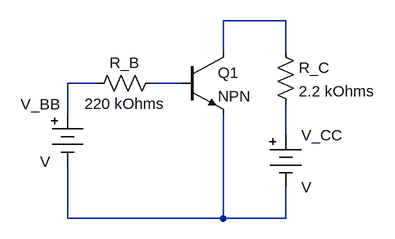
[diagram p0: schematic fig1.asc]
fig1.asc, the LTspice schematic file:
Version 4
SHEET 1 880 680
WIRE 304 -32 208 -32
WIRE 208 16 208 -32
WIRE 304 16 304 -32
WIRE 16 64 -32 64
WIRE 144 64 96 64
WIRE -32 112 -32 64
WIRE 304 144 304 96
WIRE -32 272 -32 192
WIRE 208 272 208 112
WIRE 208 272 -32 272
WIRE 304 272 304 224
WIRE 304 272 208 272
SYMBOL npn 144 16 R0
SYMATTR InstName Q1
SYMBOL res 288 0 R0
SYMATTR InstName R_C
SYMATTR Value 2.2 kOhms
SYMBOL Misc\\battery 304 128 R0
SYMATTR InstName V_CC
SYMBOL res 112 48 R90
WINDOW 0 0 56 VBottom 2
WINDOW 3 32 56 VTop 2
SYMATTR InstName R_B
SYMATTR Value 220 kOhms
SYMBOL Misc\\battery -32 96 R0
WINDOW 0 -72 0 Left 2
WINDOW 3 -42 89 Left 2
SYMATTR InstName V_BB

The netlist it stands for:
* fig1.asc
Q1 N001 N003 N005 0 NPN
R_C N001 N004 2.2 kOhms
V_CC N004 N005 V
R_B N003 N002 220 kOhms
V_BB N002 N005 V
.model NPN NPN
.model PNP PNP
.lib standard.bjt
.backanno
.end